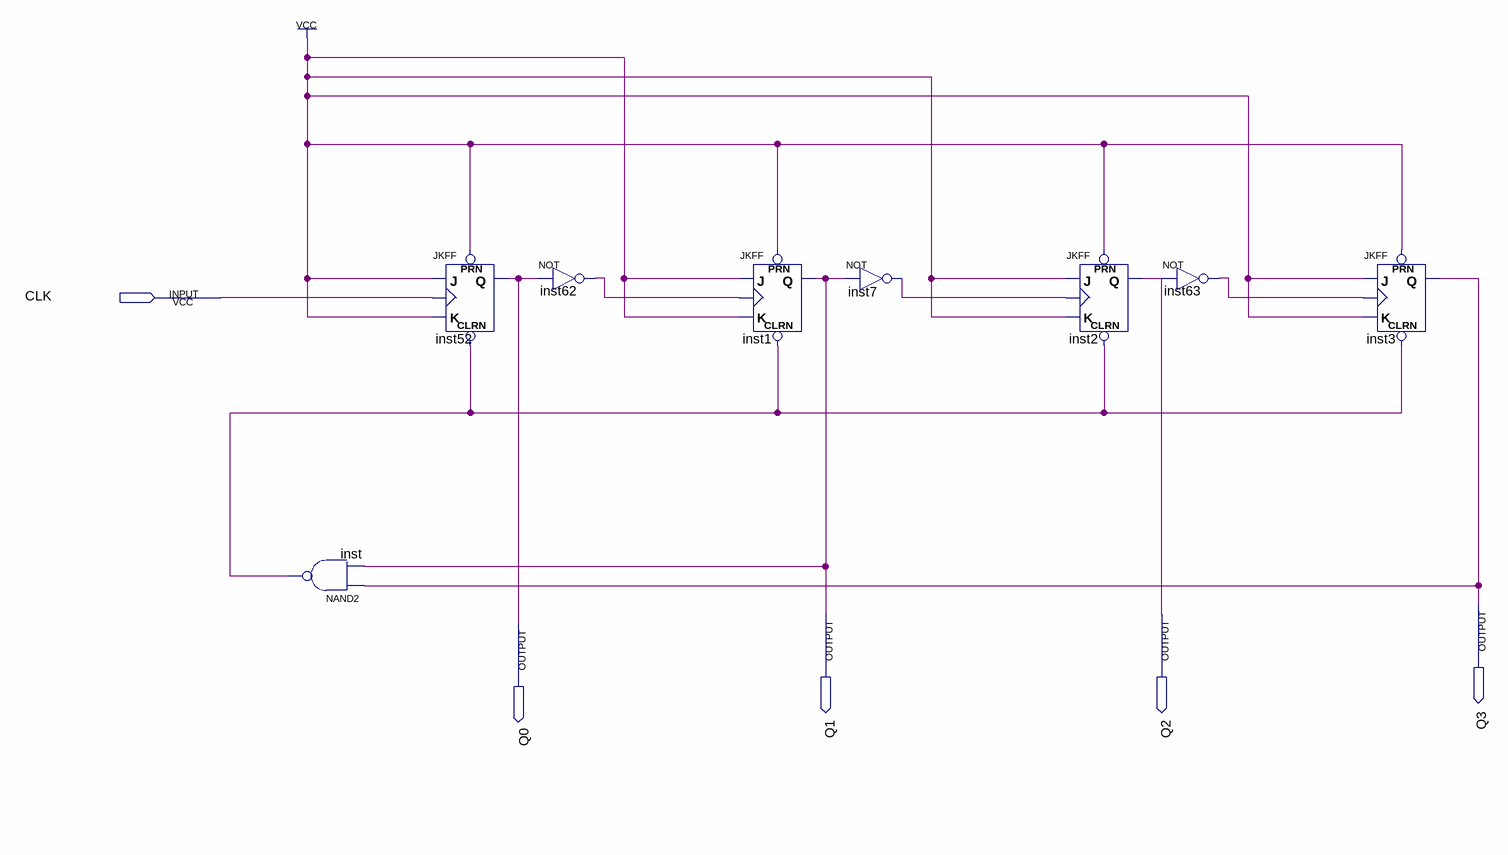
[diagram p0: schematic sheet]
// Quartus schematic ModDieciseisTruncadoDiez.bdf as structural Verilog: 8 symbols, 5 pins
module ModDieciseisTruncadoDiez (
  input  CLK,
  output Q3,
  output Q1,
  output Q2,
  output Q0
);

  wire inst7_out, inst62_out, inst63_out, inst_out;

  nand inst (inst_out, Q3, Q1);
  JKFF inst52 (.PRN(1'b1), .CLRN(inst_out), .K(1'b1), .J(1'b1), .CLK(CLK), .Q(Q0));
  not inst62 (inst62_out, Q0);
  JKFF inst1 (.PRN(1'b1), .CLRN(inst_out), .K(1'b1), .J(1'b1), .CLK(inst62_out), .Q(Q1));
  not inst7 (inst7_out, Q1);
  JKFF inst2 (.PRN(1'b1), .CLRN(inst_out), .K(1'b1), .J(1'b1), .CLK(inst7_out), .Q(Q2));
  not inst63 (inst63_out, Q2);
  JKFF inst3 (.PRN(1'b1), .CLRN(inst_out), .K(1'b1), .J(1'b1), .CLK(inst63_out), .Q(Q3));
endmodule
